# Altium schematic sheet ISO_Power.SchDoc
size A3; SheetNumber: 4; SheetTotal: 8
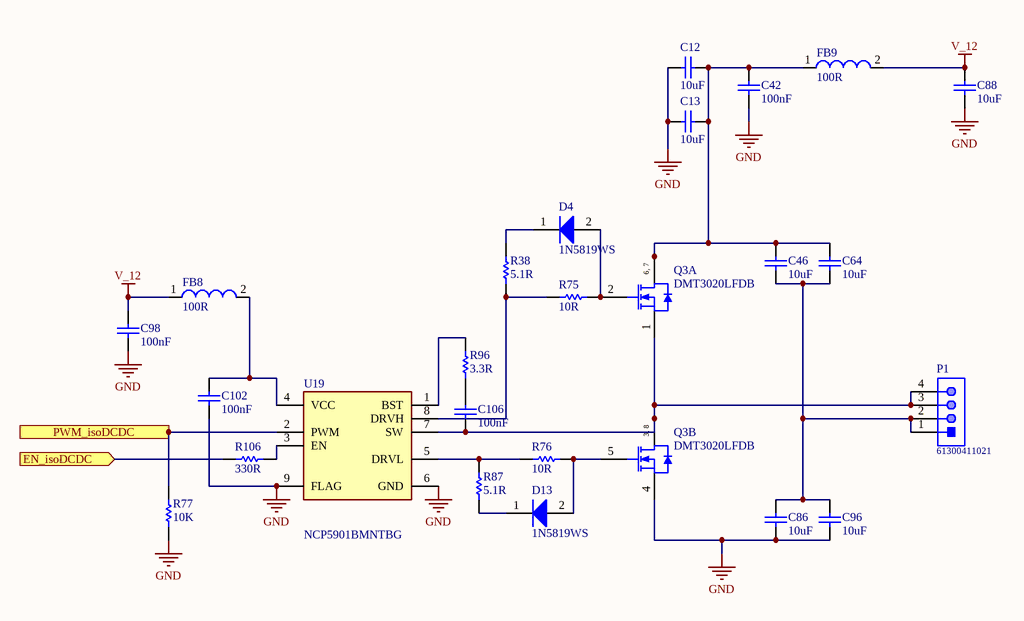
[diagram p0: ISO_Power.SchDoc]

## Parts
C12  10uF  [CAPC2013X140X45NL15T25]
C13  10uF  [CAPC2013X140X45NL15T25]
C42  100nF  [CAPC1608X90X35NL10T15]
C46  10uF  [CAPC2013X140X45NL15T25]
C64  10uF  [CAPC2013X140X45NL15T25]
C86  10uF  [CAPC2013X140X45NL15T25]
C88  10uF  [CAPC2013X140X45NL15T25]
C96  10uF  [CAPC2013X140X45NL15T25]
C98  100nF  [CAPC1608X90X35NL10T15]
C102  100nF  [CAPC1608X90X35NL10T15]
C106  100nF  [CAPC1608X90X35NL10T15]
D4  1N5819WS  [ONSC-SOD-323-2-477-02_V]
D13  1N5819WS  [ONSC-SOD-323-2-477-02_V]
FB8  100R  [SMD-0603]
FB9  100R  [SMD-0603]
P1  61300411021  [61300411021]
Q3  DMT3020LFDB  [NXP-SOT1118_L]  (parts A,B of 2)
R38  5.1R  [RESC1608X55X30NL15T15]
R75  10R  [RESC1608X55X25NL10T15]
R76  10R  [RESC1608X55X25NL10T15]
R77  10K  [RESC1608X55X25NL10T15]
R87  5.1R  [RESC1608X55X30NL15T15]
R96  3.3R  [RESC1608X55X30NL15T15]
R106  330R  [RESC1608X55X25NL10T15]
U19  NCP5901BMNTBG  [SON50P200X200X100-9N]

## Ports
EN_isoDCDC (in), PWM_isoDCDC (in)

## Nets
GND: C12.2 C13.2 C42.1 C86.2 C88.2 C96.2 C98.1 C102.1 Q3.4(S2) R77.1 U19.6(GND) U19.9(FLAG)
V_12: C88.1 C98.2 FB8.1 FB9.2
EN_isoDCDC: R106.2 ; port EN_isoDCDC
PWM_isoDCDC: R77.2 U19.2(PWM) ; port PWM_isoDCDC
NetC12_1: C12.1 C13.1 C42.2 C46.1 C64.1 FB9.1 Q3.6(D1) Q3.7(D1)
NetC46_2: C46.2 C64.2 C86.1 C96.1 P1.1 P1.2
NetC102_2: C102.2 FB8.2 U19.4(VCC)
NetC106_1: C106.1 P1.3 P1.4 Q3.1(S1) Q3.3(D2) Q3.8(D2) U19.7(SW)
NetC106_2: C106.2 R96.1
NetD4_1: D4.1(K) R38.2
NetD4_2: D4.2(A) Q3.2(G1) R75.2
NetD13_1: D13.1(K) R87.1
NetD13_2: D13.2(A) Q3.5(G2) R76.2
NetR38_1: R38.1 R75.1 U19.8(DRVH)
NetR76_1: R76.1 R87.2 U19.5(DRVL)
NetR96_2: R96.2 U19.1(BST)
NetR106_1: R106.1 U19.3(EN)

## Notes on the sheet
- (in symbol CMP-1258-00008-1, part A) 6, 7
- (in symbol CMP-1258-00008-1, part B) 3, 8

## Library data of the parts
C12 C13 C46 C64 C86 C88 C96 = CMP-2007-03395-1: X5R 25V ±10% 10uF 0805 Multilayer Ceramic Capacitors MLCC - SMD/SMT ROHS; Part Number: GRM21BR71A106KE51L; Manufacturer: Murata; Parameter 1: *; JLCPCB Part #: C15850
C42 C98 C102 C106 = CAP: X7R 100nF ±10% 50V 0603 Multilayer Ceramic Capacitors MLCC - SMD/SMT ROHS; Part Number: GCM188R72A104KA64D; Manufacturer: Murata; Manufacturer Part Number: CC0603KRX7R9BB104; Voltage Rating: 100V; Supplier 1: Arrow Electronics; Supplier Part Number 1: GCM188R72A104KA64D; RoHS: Yes; Category: Ceramic Capacitors; Mount: Surface Mount; Case/Package: 0603; Case Code (Imperial): 0603; Case Code (Metric): 1608; Min Operating Temperature: -55°C; Max Operating Temperature: 125°C; Tolerance: 10%; Packaging: Tape and Reel; Capacitance: 100nF; Dielectric: X7R; Termination: SMD/SMT; Voltage Rating (DC): 100V; Length: 1.6mm; Height: 0.8mm; Depth: 0.8mm; Radiation Hardening: No; ComponentLink1URL: https://datasheet.ciiva.com/17451/product-17451047.pdf?src-supplier=Avnet+Europe; ComponentLink1Description: https://datasheet.ciiva.com/17451/product-17451047.pdf?src-supplier=Avnet+Europe; ComponentLink2URL: https://datasheet.ciiva.com/26889/getdatasheetpartid-387765-26889164.pdf?src-supplier=Verical; ComponentLink2Description: https://datasheet.ciiva.com/26889/getdatasheetpartid-387765-26889164.pdf?src-supplier=Verical; Parameter 1: *; JLCPCB Part #: C14663
D4 D13 = CMP-1055-00462-1: 40V 1A 600mV @ 1A SOD-323 Schottky Barrier Diodes (SBD) ROHS; PartNumber: BAT54HT1G; Manufacturer: On Semiconductor; Configuration: Single; trr Max (ns): 5; Packing: Tape and Reel; IFSM Max (A): 0.6; ComponentLink3URL: http://www.onsemi.com/pub_link/Collateral/477-02.PDF.1; PackageDescription: 2-Pin SOD, Body 1.7 x 1.25 mm; ComponentLink2URL: http://www.onsemi.cn/pub_link/Collateral/BAT54HT1-D.PDF; ComponentLink3Description: Package Specification; ComponentLink2Description: Datasheet; DatasheetVersion: Rev. 6; PackageReference: SOD-323-2-477-02; RoHS: TRUE; ComponentLink1URL: http://www.onsemi.com/; Mounting Technology: Surface Mount; ComponentLink1Description: Manufacturer URL; PackageVersion: Rev. H, 03/2007; Parameter 1: *; JLCPCB Part #: C191023
FB8 = CMP-0220-00115-1: SMD EMI Suppression Ferrite Bead WE-CBF, Z = 1500 Ohm; DatasheetVersion: Dec-2005; ComponentLink1URL: http://www.we-online.com; PackageVersion: 2009; PackageDescription: Chip Inductor, 2-Leads, Body 1.6 x 0.8 mm; ComponentLink2URL: http://www.we-online.de/katalog/media/pdf/742792691.pdf; ComponentLink1Description: Manufacturer Link; ComponentLink2Description: Datasheet; Impedance: 1500 Ohm; PackageReference: SMD-0603; Parameter 1: *; JLCPCB Part #: *
FB9 = PAS-IND-INDUCTOR-2: SMD EMI Suppression Ferrite Bead WE-CBF, Z = 1500 Ohm; DatasheetVersion: Dec-2005; ComponentLink1URL: http://www.we-online.com; PackageVersion: 2009; PackageDescription: Chip Inductor, 2-Leads, Body 1.6 x 0.8 mm; ComponentLink2URL: http://www.we-online.de/katalog/media/pdf/742792691.pdf; ComponentLink1Description: Manufacturer Link; ComponentLink2Description: Datasheet; Impedance: 1500 Ohm; PackageReference: SMD-0603; Parameter 1: *; JLCPCB Part #: *
P1 = WE-CN-1P-M-R4: THT Angled Pin Header WR-PHD, Pitch 2.54 mm, Single Row, 4 pins; Manufacturer: Wurth Elektronik; Gender: Male; Pin Number: 4; Withstanding Voltage: 500VAC; Working Voltage: 250VAC; Contact Resistance: 20mOhm; Pitch: 2.54mm; Rated Current: 3A; Manufacturer URL: http://www.we-online.de; Mounting Technology: THT; Publisher: WurthElektronik; Operating Temperature: -40to105degC; Packaging: Bag; Row Number: Single; Package Reference: 61300411021; Part Number: 61300411021; Orientation: Angled; Datasheet URL: https://katalog.we-online.de/em/datasheet/6130xx11021.pdf; Parameter 1: *; JLCPCB Part #: *
Q3 = CMP-1258-00008-1: Dual N-Channel Trench MOSFET, 30 V, -55 to 150 degC, 8-Pin SOT1118, Reel; Manufacturer: NXP Semiconductors; PartNumber: PMDPB56XN,115; Channel Type: N; VGSth [typ] (V): 1; VDS [max] (V): 30; Coss [typ] (pF): 35; Ciss [typ] (pF): 170; PackageVersion: 13-06-06, 06/2013; Packing: Reel; DatasheetVersion: Rev. 1; ComponentLink3Description: Package Specification; PackageDescription: 6-Pin Small Outline No-Lead, Body 2 x 2 mm, Pitch 0.65 mm; PackageReference: SOT1118; ComponentLink2URL: http://www.nxp.com/documents/data_sheet/PMDPB56XN.pdf; ComponentLink2Description: Datasheet; Mounting Technology: Surface Mount; ComponentLink1Description: Manufacturer URL; ComponentLink1URL: http://www.nxp.com/; ComponentLink3URL: http://www.nxp.com/documents/outline_drawing/sot1118_po.pdf; Parameter 1: *; JLCPCB Part #: *
R38 R87 = RES: ±1% ±400ppm/℃ 5.1Ω 0.1W 0603 Chip Resistor - Surface Mount ROHS; Part Number: ERJ3EKF1803V; Manufacturer: Panasonic; Manufacturer Part Number: ERJ-3EKF1803V; Resistance: 180kR; Power Rating: 100mW; Voltage Rating: 75V; Temperature Coefficient: 100ppm/°C; Supplier 1: Digi-Key; Supplier Part Number 1: P180KHCT-ND; RoHS: Yes; Category: Chip SMD Resistors; Stock 1: 113875; Pricing 1: 1=0.10000, 10=0.06100, 100=0.02460, 1000=0.01106, 2500=0.00960 (USD); Mount: Surface Mount; Case/Package: 0603; Case Code (Metric): 1608; Case Code (Imperial): 0603; Contact Plating: Tin; Weight: 7.1E-05oz; Min Operating Temperature: -55°C; Max Operating Temperature: 155°C; Tolerance: 1%; Packaging: Tape and Reel; Resistor Type: Thick Film; Series: ERJ; Package Quantity: 1; Number of Terminations: 2; Termination: SMD/SMT; Max Power Dissipation: 100mW; Voltage Rating (DC): 75V; Construction: Rectangular; Features: Automotive AEC-Q200; Resistance Tolerance: 1%; Length: 1.6mm; Width: 0.031inch; Height: 0.022inch; Depth: 0.8mm; Radiation Hardening: No; RoHS Compliant: Yes; Military Standard: Not; Lead Free: Lead Free; REACH SVHC: No SVHC; ComponentLink1URL: https://datasheet.ciiva.com/22739/426256-22739797.pdf?src-supplier=Element14; ComponentLink1Description: https://datasheet.ciiva.com/22739/426256-22739797.pdf?src-supplier=Element14; ComponentLink2URL: https://datasheet.ciiva.com/24162/aoa0000ce2-24162661.pdf?src-supplier=Mouser; ComponentLink2Description: https://datasheet.ciiva.com/24162/aoa0000ce2-24162661.pdf?src-supplier=Mouser; ComponentLink3URL: https://datasheet.ciiva.com/30137/aoa0000ce2-30137813.pdf?src-supplier=Onlinecomponents.com; ComponentLink3Description: https://datasheet.ciiva.com/30137/aoa0000ce2-30137813.pdf?src-supplier=Onlinecomponents.com; ComponentLink4URL: https://datasheet.ciiva.com/46436/1678782-46436790.pdf?src-supplier=Element14; ComponentLink4Description: https://datasheet.ciiva.com/46436/1678782-46436790.pdf?src-supplier=Element14; ComponentLink5URL: https://datasheet.ciiva.com/46436/1678782-46436791.pdf?src-supplier=Element14; ComponentLink5Description: https://datasheet.ciiva.com/46436/1678782-46436791.pdf?src-supplier=Element14; ComponentLink6URL: https://datasheet.ciiva.com/16782/70260748-16782408.pdf?src-supplier=Allied+Electronics; ComponentLink6Description: https://datasheet.ciiva.com/16782/70260748-16782408.pdf?src-supplier=Allied+Electronics; ComponentLink7URL: https://datasheet.ciiva.com/17207/aoa0000ce2-17207208.pdf?src-supplier=Avnet+Europe; ComponentLink7Description: https://datasheet.ciiva.com/17207/aoa0000ce2-17207208.pdf?src-supplier=Avnet+Europe; ComponentLink8URL: https://datasheet.ciiva.com/28568/1678782-28568699.pdf?src-supplier=Element14; ComponentLink8Description: https://datasheet.ciiva.com/28568/1678782-28568699.pdf?src-supplier=Element14; ComponentLink9URL: https://datasheet.ciiva.com/5915/aoa0000ce2-5915294.pdf?src-supplier=Farnell; ComponentLink9Description: https://datasheet.ciiva.com/5915/aoa0000ce2-5915294.pdf?src-supplier=Farnell; ComponentLink10URL: https://datasheet.ciiva.com/9184/aoa0000ce2-9184911.pdf?src-supplier=Avnet; ComponentLink10Description: https://datasheet.ciiva.com/9184/aoa0000ce2-9184911.pdf?src-supplier=Avnet; Parameter 1: *; JLCPCB Part #: C25197
R75 R76 = CMP-1659-00008-4: ±1% ±400ppm/℃ 10Ω 0.1W 0603 Chip Resistor - Surface Mount ROHS; Manufacturer: Yageo; Manufacturer Part Number: RC0603FR-0710RL; Voltage Rating: 50 V; Temperature Coefficient: 200ppm/°C; Power Rating: 100mW; Voltage Rating (DC): 50V; PackageReference: 0603; ComponentLink3Description: Package Specification; Packaging: Tape and Reel; Max Operating Temperature: 155 degC; ComponentLink3URL: http://www.farnell.com/datasheets/443971.pdf; PackageDescription: 2-Pin Surface Mount Device, Body 1.6 x 0.8 mm; ComponentLink1URL: http://www.yageo.com/; Pins: 2; REACH SVHC: No SVHC; RoHSCompliant: true; ComponentLink2URL: http://www.yageo.com/documents/recent/PYu-RC_Group_51_RoHS_L_04.pdf; DatasheetVersion: Rev. 4, 02/2016; Mount: Surface Mount; Package Quantity: 200; Min Operating Temperature: -55 degC; Height: 0.45 mm; Mounting Technology: Surface Mount; ComponentLink1Description: Manufacturer URL; ComponentLink2Description: Datasheet; Length: 1.6 mm; Supplier 1: Digi-Key; Supplier Part Number 1: 311-10.0HRCT-ND; RoHS: Yes; Category: Chip SMD Resistors; Stock 1: 589691; Pricing 1: 1=0.10000, 10=0.04800, 100=0.01940, 1000=0.00872, 2500=0.00756 (USD); Case/Package: 0603; Number of Pins: 2; Case Code (Imperial): 0603; Case Code (Metric): 1608; Contact Plating: Tin,Matte; Size Code: 0603; Resistance: 10R; Tolerance: 1%; Resistor Type: Thick Film; Max Power Dissipation: 100mW; Number of Terminations: 2; Termination: SMD/SMT; Series: RC; Resistance Tolerance: 1%; Features: Moisture Resistant; Construction: Rectangular; Technology: THICK FILM; Width: 0.8mm; Depth: 0.8mm; Radiation Hardening: No; RoHS Compliant: Yes; Military Standard: Not; Lead Free: Lead Free; ComponentLink4URL: https://datasheet.ciiva.com/11808/0900766b80f96399-11808140.pdf?src-supplier=RSComponents; ComponentLink4Description: https://datasheet.ciiva.com/11808/0900766b80f96399-11808140.pdf?src-supplier=RSComponents; ComponentLink5URL: https://datasheet.ciiva.com/7746/443971-7746245.pdf?src-supplier=Element14; ComponentLink5Description: https://datasheet.ciiva.com/7746/443971-7746245.pdf?src-supplier=Element14; ComponentLink6URL: https://datasheet.ciiva.com/8891/pyu-rc0603-51-rohs-l-4-8891285.pdf?src-supplier=Avnet; ComponentLink6Description: https://datasheet.ciiva.com/8891/pyu-rc0603-51-rohs-l-4-8891285.pdf?src-supplier=Avnet; ComponentLink7URL: https://datasheet.ciiva.com/28386/pyu-rc0603-51-rohs-l-4-28386637.pdf?src-supplier=Avnet+Europe; ComponentLink7Description: https://datasheet.ciiva.com/28386/pyu-rc0603-51-rohs-l-4-28386637.pdf?src-supplier=Avnet+Europe; Parameter 1: *; JLCPCB Part #: C22859
R77 = RES-2: ±1% ±100ppm/℃ 10kΩ 0.1W 0603 Chip Resistor - Surface Mount ROHS; Manufacturer: Yageo; Manufacturer Part Number: RC0603JR-071ML; Power Rating: 100mW; Resistance Tolerance: ±5%; Product Range: RCSeries; Temperature Coefficient: ±100ppm/°C; Resistor Element Type: ThickFilm; Resistance: 1Mohm; SVHC: ToBeAdvised; Voltage Rating: 50V; Resistor Case Style: 0603[1608Metric]; Tolerance: 5%; MSL: MSL1-Unlimited; Package Description: 2-Pin Surface Mount Device, Body 1.6 x 0.8 mm; Datasheet Version: Rev. 7, 05/2017; Datasheet URL: http://www.yageo.com/documents/recent/PYu-RC_Group_51_RoHS_L_7.pdf; Manufacturer URL: http://www.yageo.com/; Package Reference: 0603; Automotive Qualification Standard: -; Packaging: CutTape; Mounting Technology: SurfaceMount; Supplier 1: Digi-Key; Supplier Part Number 1: 311-1.0MGRCT-ND; Stock 1: 3949362; Pricing 1: 1=0,10000, 10=0,01900, 100=0,00770, 1000=0,00347, 2500=0,00301 (USD); RoHS: Yes; Case/Package: 0603; Number of Pins: 2; Case Code (Imperial): 0603; Case Code (Metric): 1608; Contact Plating: Tin,Matte; Min Operating Temperature: -55°C; Max Operating Temperature: 155°C; Composition: Thick Film; Termination: SMD/SMT; Package Quantity: 5000; Military Standard: Not; Voltage Rating (DC): 50V; Length: 1.6mm; Height: 0.45mm; Width: 0.8mm; Depth: 0.8mm; Radiation Hardening: No; Lead Free: Lead Free; REACH SVHC: No SVHC; ComponentLink1URL: https://datasheet.ciiva.com/46395/443971-46395067.pdf?src-supplier=Element14; ComponentLink1Description: https://datasheet.ciiva.com/46395/443971-46395067.pdf?src-supplier=Element14; ComponentLink2URL: https://datasheet.ciiva.com/8883/pyu-rc0603-51-rohs-l-4-8883053.pdf?src-supplier=Avnet; ComponentLink2Description: https://datasheet.ciiva.com/8883/pyu-rc0603-51-rohs-l-4-8883053.pdf?src-supplier=Avnet; ComponentLink3URL: https://datasheet.ciiva.com/12555/rc0603-272842-12555342.pdf?src-supplier=Mouser; ComponentLink3Description: https://datasheet.ciiva.com/12555/rc0603-272842-12555342.pdf?src-supplier=Mouser; ComponentLink4URL: https://datasheet.ciiva.com/7746/443971-7746463.pdf?src-supplier=Element14; ComponentLink4Description: https://datasheet.ciiva.com/7746/443971-7746463.pdf?src-supplier=Element14; Parameter 1: *; JLCPCB Part #: C25804
R96 = CMP-2000-00847-1: RES SMD 3.3 OHM 1% 1/10W 0603; Part Number: ERJ-3RQF3R3V; Manufacturer: Panasonic; Temperature Coefficient: 200ppm/°C; Max Power Dissipation: 100mW; Supplier 1: Digi-Key; Supplier Part Number 1: P3.3AJCT-ND; Manufacturer Part Number: ERJ-3RQF3R3V; RoHS: Yes; Category: Chip SMD Resistors; Stock 1: 14; Pricing 1: 1=0.16000, 10=0.13600, 25=0.09920, 50=0.07200, 100=0.05330, 250=0.04092, 500=0.03224, 1000=0.02232 (USD); Mount: Surface Mount; Case/Package: 0603; Number of Pins: 2; Case Code (Metric): 1608; Case Code (Imperial): 0603; Contact Plating: Tin; Min Operating Temperature: -55°C; Max Operating Temperature: 125°C; Resistance: 3.3R; Tolerance: 1%; Packaging: Tape and Reel; Resistor Type: Thick Film; Series: ERJ; Package Quantity: 5000; Number of Terminations: 2; Power Rating: 100mW; Construction: Rectangular; Termination: SMD/SMT; Resistance Tolerance: 1%; Technology: THICK FILM; Length: 1.6mm; Width: 0.031inch; Height: 0.45mm; Depth: 0.8mm; Radiation Hardening: No; RoHS Compliant: Yes; Lead Free: Lead Free; Military Standard: Not; REACH SVHC: No SVHC; ComponentLink1URL: https://datasheet.ciiva.com/11818/0900766b80eefa12-11818391.pdf?src-supplier=RSComponents; ComponentLink1Description: https://datasheet.ciiva.com/11818/0900766b80eefa12-11818391.pdf?src-supplier=RSComponents; ComponentLink2URL: https://datasheet.ciiva.com/46447/391509-46447753.pdf?src-supplier=Element14; ComponentLink2Description: https://datasheet.ciiva.com/46447/391509-46447753.pdf?src-supplier=Element14; ComponentLink3URL: https://datasheet.ciiva.com/6137/391509-6137621.pdf?src-supplier=Farnell; ComponentLink3Description: https://datasheet.ciiva.com/6137/391509-6137621.pdf?src-supplier=Farnell; ComponentLink4URL: https://datasheet.ciiva.com/46447/391509-46447752.pdf?src-supplier=Element14; ComponentLink4Description: https://datasheet.ciiva.com/46447/391509-46447752.pdf?src-supplier=Element14; ComponentLink5URL: https://datasheet.ciiva.com/9196/aoa0000ce3-9196469.pdf?src-supplier=Avnet; ComponentLink5Description: https://datasheet.ciiva.com/9196/aoa0000ce3-9196469.pdf?src-supplier=Avnet; ComponentLink6URL: https://datasheet.ciiva.com/30239/6aoa0000ce3-30239769.pdf?src-supplier=Onlinecomponents.com; ComponentLink6Description: https://datasheet.ciiva.com/30239/6aoa0000ce3-30239769.pdf?src-supplier=Onlinecomponents.com; ComponentLink7URL: https://datasheet.ciiva.com/17213/aoa0000ce3-17213654.pdf?src-supplier=Avnet+Europe; ComponentLink7Description: https://datasheet.ciiva.com/17213/aoa0000ce3-17213654.pdf?src-supplier=Avnet+Europe; Parameter 1: *; JLCPCB Part #: *
R106 = RES-2: ±1% 330Ω ±100ppm/℃ 0.1W 0603 Chip Resistor - Surface Mount ROHS; Manufacturer: Yageo; Manufacturer Part Number: RC0603FR-07330RL; Tolerance: 10%; ESR: 800 mohm; Voltage Rating (DC): 16 V; Capacitance: 47 uF; Temperature Coefficient: 100ppm/°C; Power Rating: 100mW; Length: 7.3 mm; ComponentLink1URL: http://www.yageo.com/; Packaging: Tape and Reel; Pins: 2; ComponentLink1Description: Manufacturer URL; Case Code (Imperial): 2917; REACH SVHC: No SVHC; Width: 4.3 mm; ComponentLink2Description: Datasheet; Voltage Rating: 16 V; RoHSCompliant: True; Max Operating Temperature: 125degC; ComponentLink2URL: http://www.yageo.com/documents/recent/PYu-RC_Group_51_RoHS_L_04.pdf; Min Operating Temperature: -55degC; Case/Package: 2917; Radiation Hardening: No; DatasheetVersion: Rev. 4, 02/2016; Mount: Surface Mount; PackageReference: 0603; Package Quantity: 500; Case Code (Metric): 7343; PackageDescription: 2-Pin Surface Mount Device, Body 1.6 x 0.8 mm; Height: 3.1 mm; Supplier 1: Digi-Key; Supplier Part Number 1: 311-330HRCT-ND; RoHS: Yes; Category: Chip SMD Resistors; Stock 1: 4209654; Pricing 1: 1=0.10000, 10=0.02300, 100=0.00940, 1000=0.00421, 2500=0.00366 (USD); Number of Pins: 2; Composition: Thick Film; Resistance: 330R; Number of Terminations: 2; Max Power Dissipation: 100mW; Termination: SMD/SMT; Features: Moisture Resistant; Depth: 0.8mm; Lead Free: Lead Free; ComponentLink3URL: https://datasheet.ciiva.com/11819/0900766b80f96399-11819327.pdf?src-supplier=RSComponents; ComponentLink3Description: https://datasheet.ciiva.com/11819/0900766b80f96399-11819327.pdf?src-supplier=RSComponents; ComponentLink4URL: https://datasheet.ciiva.com/2454/pyu-r-int-thick-7-2454864.pdf?src-supplier=Digi-Key; ComponentLink4Description: https://datasheet.ciiva.com/2454/pyu-r-int-thick-7-2454864.pdf?src-supplier=Digi-Key; ComponentLink5URL: https://datasheet.ciiva.com/2454/pyu-r-int-thick-7-2454865.pdf?src-supplier=Digi-Key; ComponentLink5Description: https://datasheet.ciiva.com/2454/pyu-r-int-thick-7-2454865.pdf?src-supplier=Digi-Key; ComponentLink6URL: https://datasheet.ciiva.com/2454/pyu-r-int-thick-7-2454866.pdf?src-supplier=Digi-Key; ComponentLink6Description: https://datasheet.ciiva.com/2454/pyu-r-int-thick-7-2454866.pdf?src-supplier=Digi-Key; ComponentLink7URL: https://datasheet.ciiva.com/12555/rc0603-272842-12555334.pdf?src-supplier=Mouser; ComponentLink7Description: https://datasheet.ciiva.com/12555/rc0603-272842-12555334.pdf?src-supplier=Mouser; ComponentLink8URL: https://datasheet.ciiva.com/46440/1868787-46440904.pdf?src-supplier=Element14; ComponentLink8Description: https://datasheet.ciiva.com/46440/1868787-46440904.pdf?src-supplier=Element14; ComponentLink9URL: https://datasheet.ciiva.com/7746/443971-7746329.pdf?src-supplier=Element14; ComponentLink9Description: https://datasheet.ciiva.com/7746/443971-7746329.pdf?src-supplier=Element14; ComponentLink10URL: https://datasheet.ciiva.com/7746/443971-7746330.pdf?src-supplier=Element14; ComponentLink10Description: https://datasheet.ciiva.com/7746/443971-7746330.pdf?src-supplier=Element14; ComponentLink11URL: https://datasheet.ciiva.com/7746/1686128-7746331.pdf?src-supplier=Element14; ComponentLink11Description: https://datasheet.ciiva.com/7746/1686128-7746331.pdf?src-supplier=Element14; Parameter 1: *; JLCPCB Part #: C23138
U19 = NCP5901BMNTBG: Integrated Circuit; Manufacturer_Name: ON Semiconductor; Datasheet Link: http://www.onsemi.com/pub/Collateral/NCP5901B-D.PDF; Height: 1mm; Manufacturer_Part_Number: NCP5901BMNTBG; Mouser Part Number: 863-NCP5901BMNTBG; Mouser Price/Stock: https://www.mouser.co.uk/ProductDetail/ON-Semiconductor/NCP5901BMNTBG?qs=UikTwjRNStJje%252BaGWM%2F5BQ%3D%3D; Arrow Part Number: NCP5901BMNTBG; Arrow Price/Stock: https://www.arrow.com/en/products/ncp5901bmntbg/on-semiconductor; Parameter 1: *; JLCPCB Part #: *